# EAGLE design CAN-Shield (EAGLE 7.4.0)
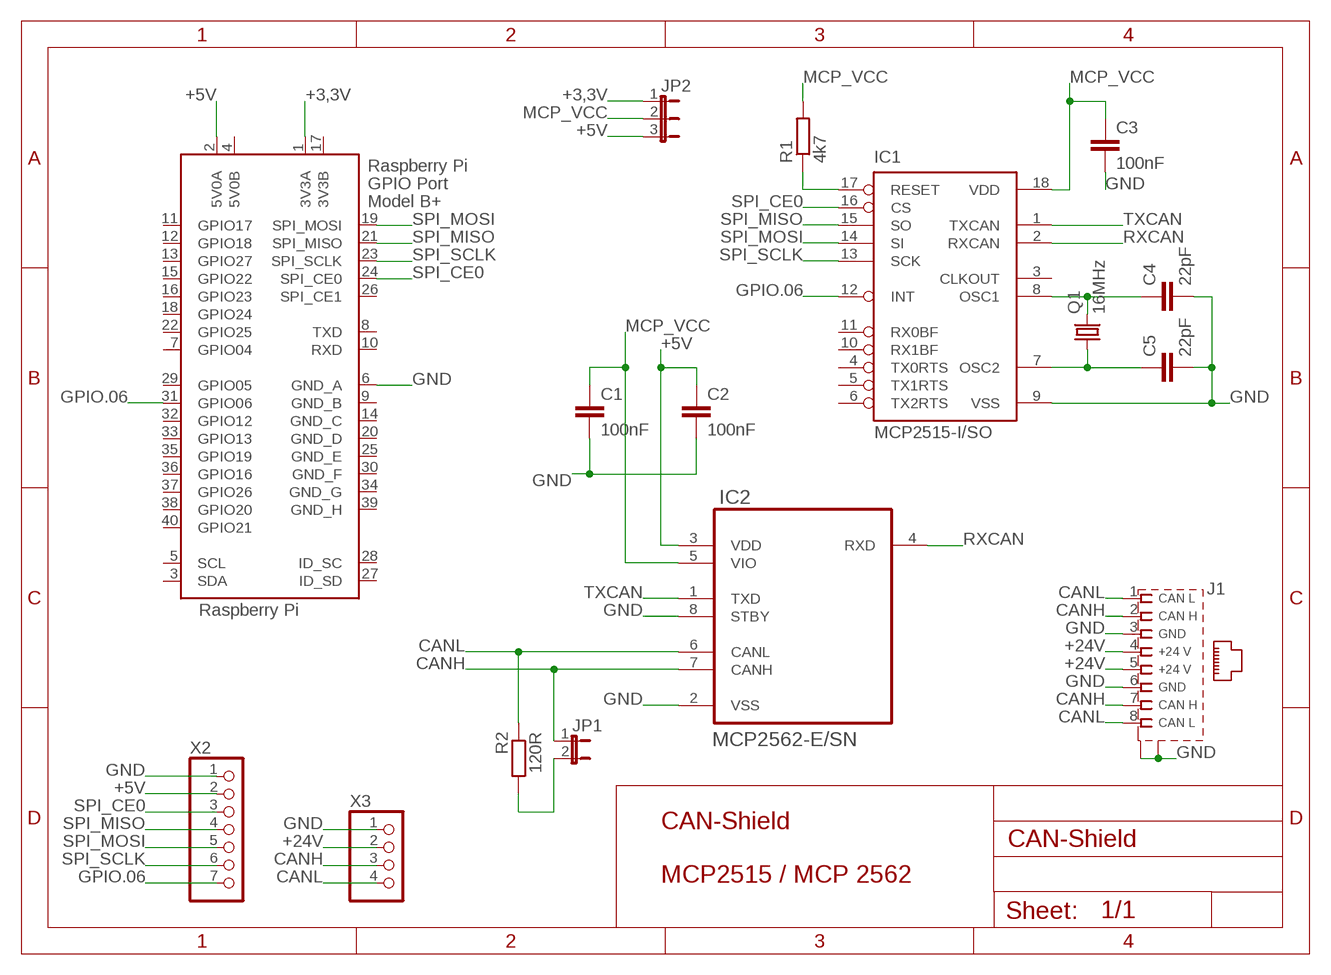
[diagram p0: schematic, sheet 1]

## Parts
C1  100nF  C-EUC1206  [C1206]
C2  100nF  C-EUC1206  [C1206]
C3  100nF  C-EUC1206  [C1206]
C4  22pF  C-EUC1206  [C1206]
C5  22pF  C-EUC1206  [C1206]
IC1  MCP2515-I/SO  [SO18L]
IC2  MCP2562-E/SN  [SO08]
J1  RJ45-CAN  [MEBP_8-8G]
JP1  JP1E  [JP1]
JP2  JP2E  [JP2]
Q1  16MHz  CRYSTALHC49UP  [HC49UP]
R1  4k7  R-EU_R1206  [R1206]
R2  120R  R-EU_R1206  [R1206]
X1  RASPI_GPIO_B+#_PIN  [RASPI_GPIO_B+_PIN]
X2  PINHD-1X7  [1X07]
X3  PINHD-1X4  [1X04]

## Nets
+3,3V: JP2.1 X1.1(3V3A)
+5V: C2.1 IC2.3(VDD) JP2.3 X1.2(5V0A) X2.2
+24V [24V]: J1.4 J1.5 X3.2
CANH: IC2.7(CANH) J1.2 J1.7 JP1.1 X3.3
CANL: IC2.6(CANL) J1.1 J1.8 R2.1 X3.4
GND: C1.2 C2.2 C3.2 C4.2 C5.2 IC1.9(VSS) IC2.2(VSS) IC2.8(STBY) J1.3 J1.6 J1.G1(S1) J1.G2(S2) X1.6(GND_A) X2.1 X3.1
GPIO.06: IC1.12(INT) X1.31(GPIO06) X2.7
MCP_VCC: C1.1 C3.1 IC1.18(VDD) IC2.5(VIO) JP2.2 R1.2
N$1: C4.1 IC1.8(OSC1) Q1.2
N$2: IC1.17(RESET) R1.1
N$3: JP1.2 R2.2
N$4: C5.1 IC1.7(OSC2) Q1.1
RXCAN: IC1.2(RXCAN) IC2.4(RXD)
SPI_CE0: IC1.16(CS) X1.24(SPI_CE0) X2.3
SPI_MISO: IC1.15(SO) X1.21(SPI_MISO) X2.4
SPI_MOSI: IC1.14(SI) X1.19(SPI_MOSI) X2.5
SPI_SCLK: IC1.13(SCK) X1.23(SPI_SCLK) X2.6
TXCAN: IC1.1(TXCAN) IC2.1(TXD)
Unconnected: IC1.3(CLKOUT) IC1.4(TX0RTS) IC1.5(TX1RTS) IC1.6(TX2RTS) IC1.10(RX1BF) IC1.11(RX0BF) X1.3(SDA) X1.5(SCL) X1.7(GPIO04) X1.8(TXD) X1.10(RXD) X1.11(GPIO17) X1.12(GPIO18) X1.13(GPIO27) X1.15(GPIO22) X1.16(GPIO23) X1.18(GPIO24) X1.22(GPIO25) X1.26(SPI_CE1) X1.27(ID_SD) X1.28(ID_SC) X1.29(GPIO05) X1.32(GPIO12) X1.33(GPIO13) X1.35(GPIO19) X1.36(GPIO16) X1.37(GPIO26) X1.38(GPIO20) X1.40(GPIO21)

## Notes on the sheet
- Raspberry Pi
- CAN-Shield
  
  MCP2515 / MCP 2562

## Power pins joined to a net without a drawn wire
3V3B: X1.17(3V3B)
5V0B: X1.4(5V0B)
GND_B: X1.9(GND_B)
GND_C: X1.14(GND_C)
GND_D: X1.20(GND_D)
GND_E: X1.25(GND_E)
GND_F: X1.30(GND_F)
GND_G: X1.34(GND_G)
GND_H: X1.39(GND_H)

## Library data of the parts
C1-C5 = rcl:C-EU: CAPACITOR, European symbol
IC1 = mcp2515_2551_2562:MCP2515
IC2 = mcp2515_2551_2562:MCP2562: High-Speed CAN Transceiver,DIP-8
J1 = can-bus:RJ45-CAN: RJ45 CAN-Bus Reichelt Bestell-Nr.: MEBP 8-8G
JP1 = jumper:JP1E: JUMPER
JP2 = jumper:JP2E: JUMPER
Q1 = crystal:CRYSTAL: CRYSTAL; OC_FARNELL: unknown; OC_NEWARK: unknown
R1 R2 = rcl:R-EU_: RESISTOR, European symbol
X1 = raspberrypi_bastelstube_v13:RASPI_GPIO_B+#: 2x20 header connector, all pins connected
X2 = pinhead:PINHD-1X7: PIN HEADER
X3 = pinhead:PINHD-1X4: PIN HEADER

## Net classes
1 24V: width 0.61 mm, clearance 0.356 mm

## Board
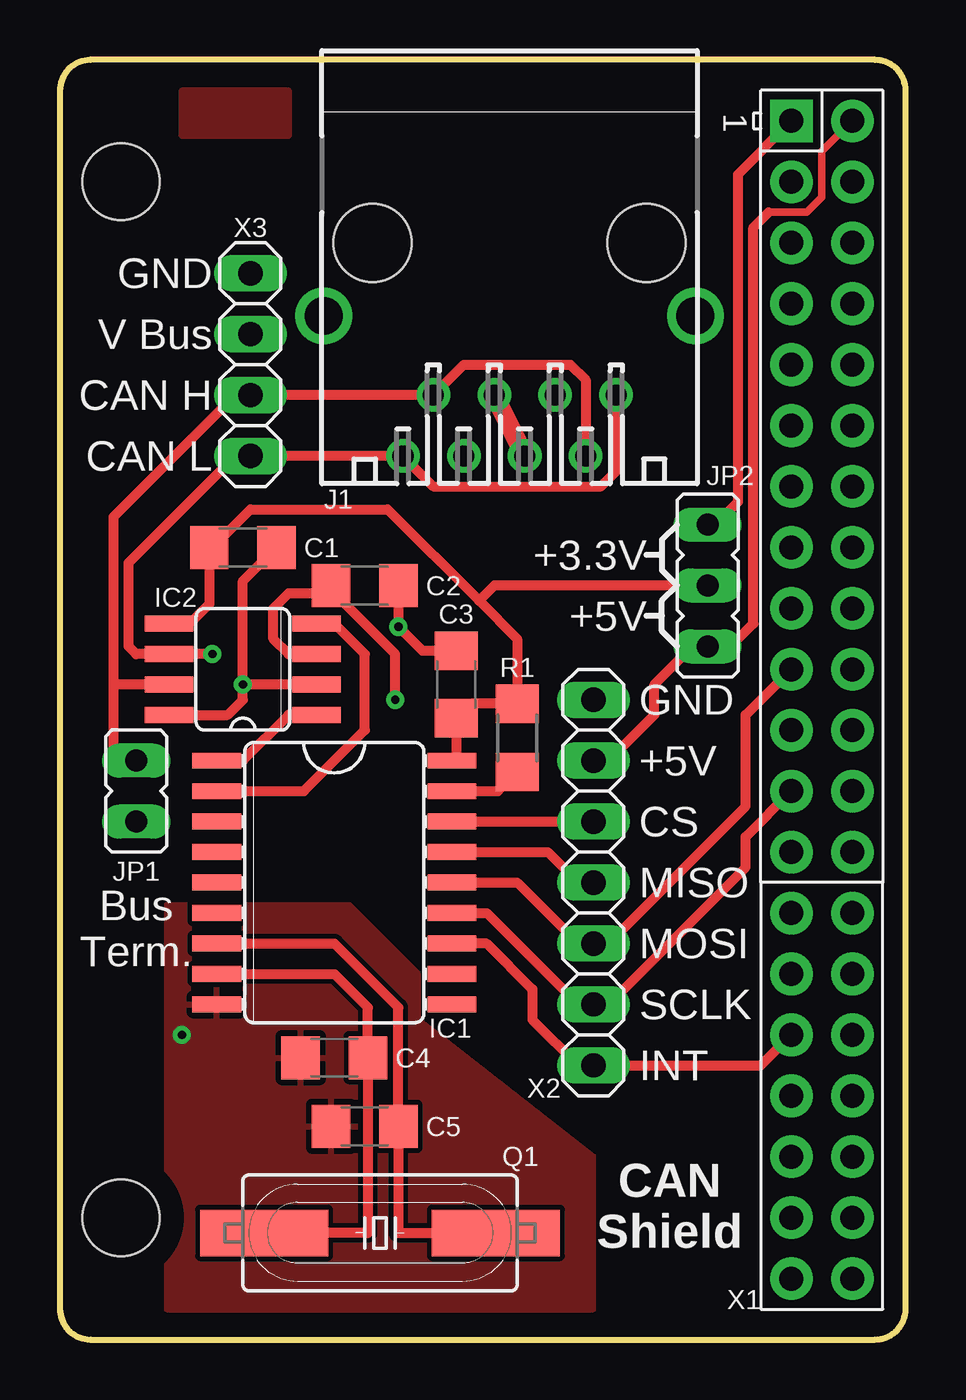
[diagram p1: board, top side]
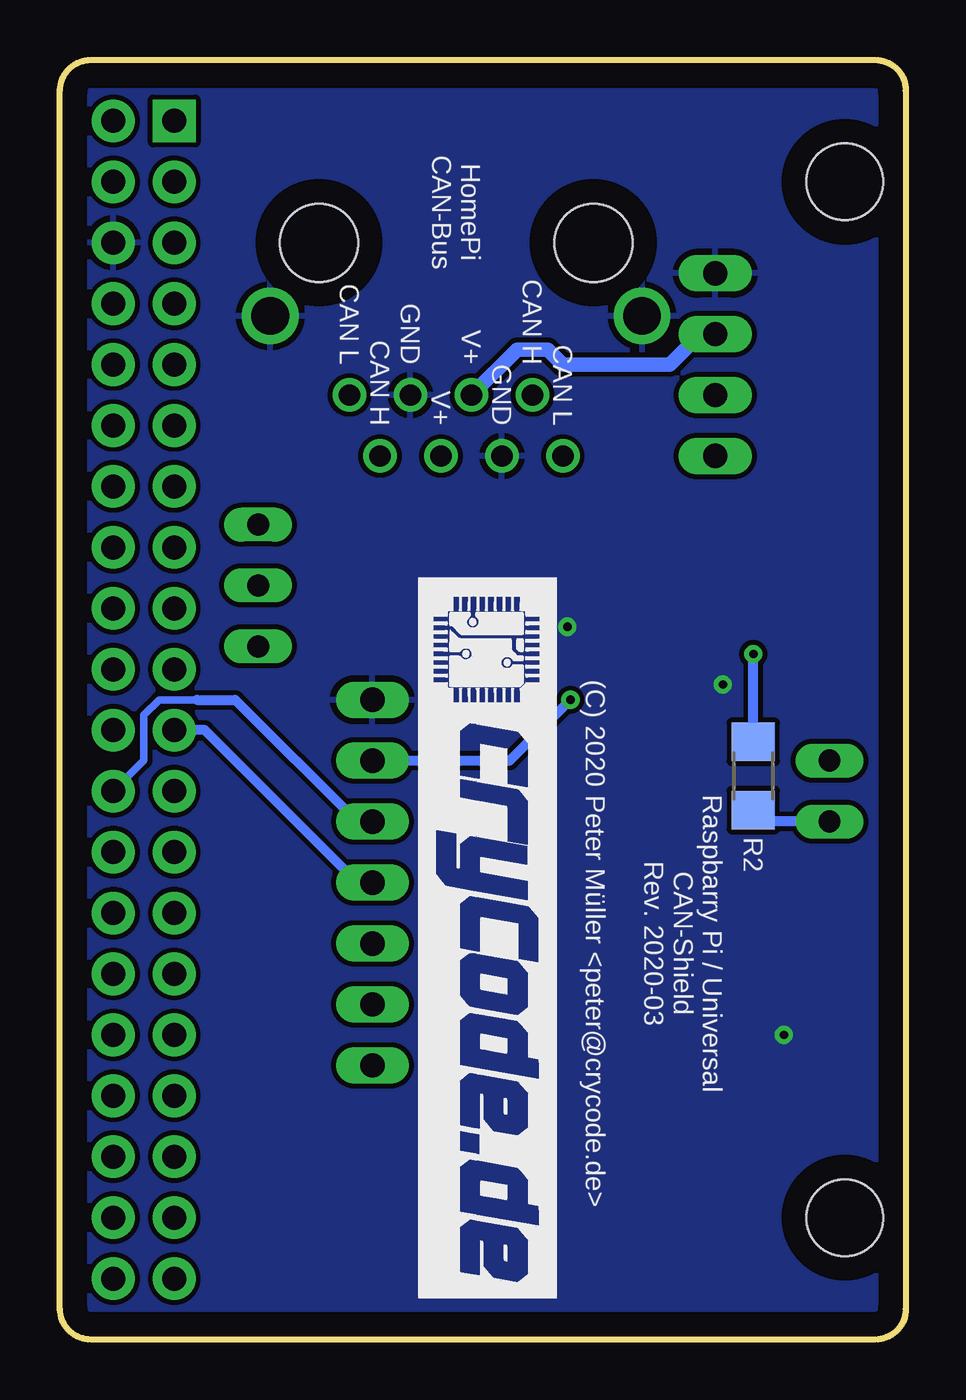
[diagram p2: board, bottom side, seen from below]

Size 35.24 x 53.34 mm. Coordinates in mm from the lower left corner, seen from the top.
Outline: 1.27,0 33.95,0 arc90 35.24,1.27 35.24,52.07 arc90 33.95,53.34 1.27,53.34 arc90 0,52.07 0,1.27 arc90 1.27,0
Copper layers (1*16): Top 0.035mm / dielectric 1.5mm / Bottom 0.035mm
Design rules "allpcb2 *": minimum track width 8mil, minimum drill 0.35mm, track to track 8mil, track to pad 8mil, pad to pad 8mil, via to via 8mil, smd to smd 6mil, copper to edge 40mil, drill to drill 8mil, minimum pad ring 10mil, minimum via ring 8mil, stop-mask expansion 0.1mm, vias tented up to drill 0.5mm, thermal gap 10mil
Holes 3.2 mm at 2.54,48.26 2.54,5.08

### Footprints (pad centres in the part's own frame; a part is rotated, then mirrored left to right if it is on the bottom)
C1206 = smd 1.6 x 1.8: 1 -1.4,0; 2 1.4,0
SO18L = smd 0.66 x 2.032: 1 -5.08,-4.902; 2 -3.81,-4.902; 3 -2.54,-4.902; 4 -1.27,-4.902; 5 0,-4.902; 6 1.27,-4.902; 7 2.54,-4.902; 8 3.81,-4.902; 9 5.08,-4.902; 10 5.08,4.902; 11 3.81,4.902; 12 2.54,4.902; 13 1.27,4.902; 14 0,4.902; 15 -1.27,4.902; 16 -2.54,4.902; 17 -3.81,4.902; 18 -5.08,4.902
SO08 = smd 0.66 x 2.032: 1 -1.905,-3.073; 2 -0.635,-3.073; 3 0.635,-3.073; 4 1.905,-3.073; 5 1.905,3.073; 6 0.635,3.073; 7 -0.635,3.073; 8 -1.905,3.073
MEBP_8-8G = drill 0.889: 1 -4.445,6.35; 2 -3.175,8.89; 3 -1.905,6.35; 4 -0.635,8.89; 5 0.635,6.35; 6 1.905,8.89; 7 3.175,6.35; 8 4.445,8.89 | drill 1.575 pad 2.184: G1 -7.745,3.05; G2 7.745,3.05 | hole 3.251: -5.715,0; 5.715,0
JP1 = drill 0.914 long: 1 0,-1.27; 2 0,1.27
JP2 = drill 0.914 long: 1 -2.54,0; 2 0,0; 3 2.54,0
HC49UP = smd 5.334 x 1.93: 1 -4.826,0; 2 4.826,0
R1206 = smd 1.6 x 1.803: 1 -1.422,0; 2 1.422,0
RASPI_GPIO_B+_PIN = drill 1 pad 1.778 square: 1 -24.13,-1.27 | drill 1 pad 1.778: 2 -24.13,1.27; 3 -21.59,-1.27; 4 -21.59,1.27; 5 -19.05,-1.27; 6 -19.05,1.27; 7 -16.51,-1.27; 8 -16.51,1.27; 9 -13.97,-1.27; 10 -13.97,1.27; 11 -11.43,-1.27; 12 -11.43,1.27; 13 -8.89,-1.27; 14 -8.89,1.27; 15 -6.35,-1.27; 16 -6.35,1.27; 17 -3.81,-1.27; 18 -3.81,1.27; 19 -1.27,-1.27; 20 -1.27,1.27; 21 1.27,-1.27; 22 1.27,1.27; 23 3.81,-1.27; 24 3.81,1.27; 25 6.35,-1.27; 26 6.35,1.27; 27 8.89,-1.27; 28 8.89,1.27; 29 11.43,-1.27; 30 11.43,1.27; 31 13.97,-1.27; 32 13.97,1.27; 33 16.51,-1.27; 34 16.51,1.27; 35 19.05,-1.27; 36 19.05,1.27; 37 21.59,-1.27; 38 21.59,1.27; 39 24.13,-1.27; 40 24.13,1.27
1X07 = drill 1.016 long: 1 -7.62,0; 2 -5.08,0; 3 -2.54,0; 4 0,0; 5 2.54,0; 6 5.08,0; 7 7.62,0
1X04 = drill 1.016 long: 1 -3.81,0; 2 -1.27,0; 3 1.27,0; 4 3.81,0

### Placement (x,y rotation side)
C1  7.62,33.02 0 top
C2  12.7,31.43 0 top
C3  16.51,27.3 90 top
C4  11.43,11.75 180 top
C5  12.7,8.89 180 top
IC1  11.43,19.05 270 top
IC2  7.62,27.94 90 top
J1  18.73,45.72 180 top
JP1  3.17,22.86 180 top
JP2  26.99,31.43 270 top
Q1  13.34,4.45 180 top
R1  19.05,25.08 90 top
R2  6.35,23.5 270 bottom
U$1  [30MM]  20.32,31.75 270 bottom
X1  31.75,26.67 270 top
X2  22.23,19.05 270 top
X3  7.94,40.64 270 top

### Tracks (layer width: path | path; a pad name or v marks a point on that pad's centre or on a via)
+3,3V
  Top 0.406: JP2.1 27.3,33.97 28.26,34.92 28.26,48.58 X1.1
+5V  (via drill 0.35 pad 0.7)
  Top 0.305: X1.2 31.75,49.53 31.75,47.62 31.11,46.99 29.53,46.99
  Top 0.406: IC2.3 9.53,28.57 8.89,29.21 8.89,30.48 9.53,31.11 10.66,31.11 C2.1 11.3,31.25 13.97,28.57 v13.97,26.67 | 29.53,46.99 28.89,46.35 28.89,29.84 27.94,28.89 JP2.3 26.35,28.89 24.77,27.3 24.77,26.04 22.86,24.13 X2.2
  Bottom 0.406: X2.2 16.51,24.13 v13.97,26.67
+24V
  Top 0.813: J1.5 J1.4
  Bottom 0.61: X3.2 8.57,41.91 9.84,40.64 14.29,40.64 14.92,41.27 16.19,41.27 J1.5
BOT
  pour Bottom: 5.08,52.07 9.53,52.07 9.53,50.16 5.08,50.16
CANH
  Top 0.406: IC2.7 2.22,27.3 | J1.2 21.91,40.01 21.27,40.64 16.83,40.64 J1.7 X3.3 7.3,39.37 2.22,34.29 2.22,27.3 | 2.22,27.3 2.22,24.45 2.54,24.13 JP1.1
CANL  (via drill 0.35 pad 0.7)
  Top 0.406: J1.1 23.18,36.2 22.54,35.56 15.56,35.56 J1.8 X3.4 7.3,36.83 2.86,32.38 2.86,28.89 3.17,28.57 IC2.6 v6.35,28.57
  Bottom 0.406: R2.1 v6.35,28.57
GND  (via drill 0.35 pad 0.7)
  Top 0.406: IC2.8 6.99,26.04 7.62,26.67 v7.62,27.3 | v7.62,27.3 7.62,31.62 C1.2 | IC2.2 v7.62,27.3 | C2.2 v14.1,29.71 15.11,28.7 C3.2
  other vias: 5.08,12.7
  pour Bottom: 0.64,0.64 34.92,0.64 34.92,52.7 0.64,52.7
  pour Top: 4.45,1.27 22.23,1.27 22.23,7.62 14.92,13.34 14.92,15.24 12.06,18.1 4.45,18.1
GPIO.06
  Top 0.406: IC1.12 17.78,16.51 19.68,14.61 19.68,13.34 21.59,11.43 X2.7 29.21,11.43 X1.31
MCP_VCC
  Top 0.406: IC2.5 5.4,29.84 6.22,30.67 C1.1 6.35,33.02 7.94,34.61 13.65,34.61 17.46,30.8 | 17.46,30.8 19.05,29.21 R1.2 17.11,26.5 C3.1 16.51,24.31 IC1.18 | JP2.2 18.1,31.43 17.46,30.8
N$1
  Top 0.406: IC1.8 11.43,15.24 12.83,13.84 C4.1 12.83,4.45 Q1.2
N$2
  Top 0.406: IC1.17 18.25,22.86 R1.1
N$3
  Bottom 0.406: JP1.2 5.87,21.59 R2.2
N$4
  Top 0.406: IC1.7 11.43,16.51 14.1,13.84 C5.1 14.1,4.45 Q1.1
RXCAN
  Top 0.406: IC1.2 10.16,22.86 12.7,25.4 12.7,28.57 11.43,29.84 IC2.4
SPI_CE0
  Top 0.406: IC1.16 X2.3
  Bottom 0.305: X1.24 31.75,24.13 31.75,26.04 31.11,26.67 29.53,26.67
  Bottom 0.406: X2.3 22.86,21.59 27.94,26.67 29.53,26.67
SPI_MISO
  Top 0.406: IC1.15 20.32,20.32 21.59,19.05 X2.4
  Bottom 0.406: X1.21 29.21,25.4 22.86,19.05 X2.4
SPI_MOSI
  Top 0.406: X1.19 28.57,26.04 28.57,22.23 22.86,16.51 X2.5 21.59,16.51 19.05,19.05 IC1.14
SPI_SCLK
  Top 0.406: IC1.13 17.78,17.78 21.59,13.97 X2.6 22.86,13.97 28.57,19.68 28.57,20.95 X1.23
TOP
  pour Top: 5.08,52.07 9.53,52.07 9.53,50.16 5.08,50.16
TXCAN
  Top 0.406: IC1.1 7.62,24.13 9.53,26.04 IC2.1

### Text on the board
bPlace: Raspbarry Pi / Universal / CAN-Shield / Rev. 2020-03 / / (C) 2020 Peter Müller <peter@crycode.de>
tNames: GND | V Bus | CAN H | CAN L | +3.3V | +5V | GND | +5V | CS | Bus / Term. | MISO | MOSI | SCLK | INT | CAN / Shield
bNames: HomePi / CAN-Bus | CAN H | V+ | GND | CAN L | CAN L | GND | V+ | CAN H
tRestrict: TOP
bRestrict: BOT